# EasyEDA Pro project STM32F743ucosiii_lg.eprj, board 游戏主板_V2505
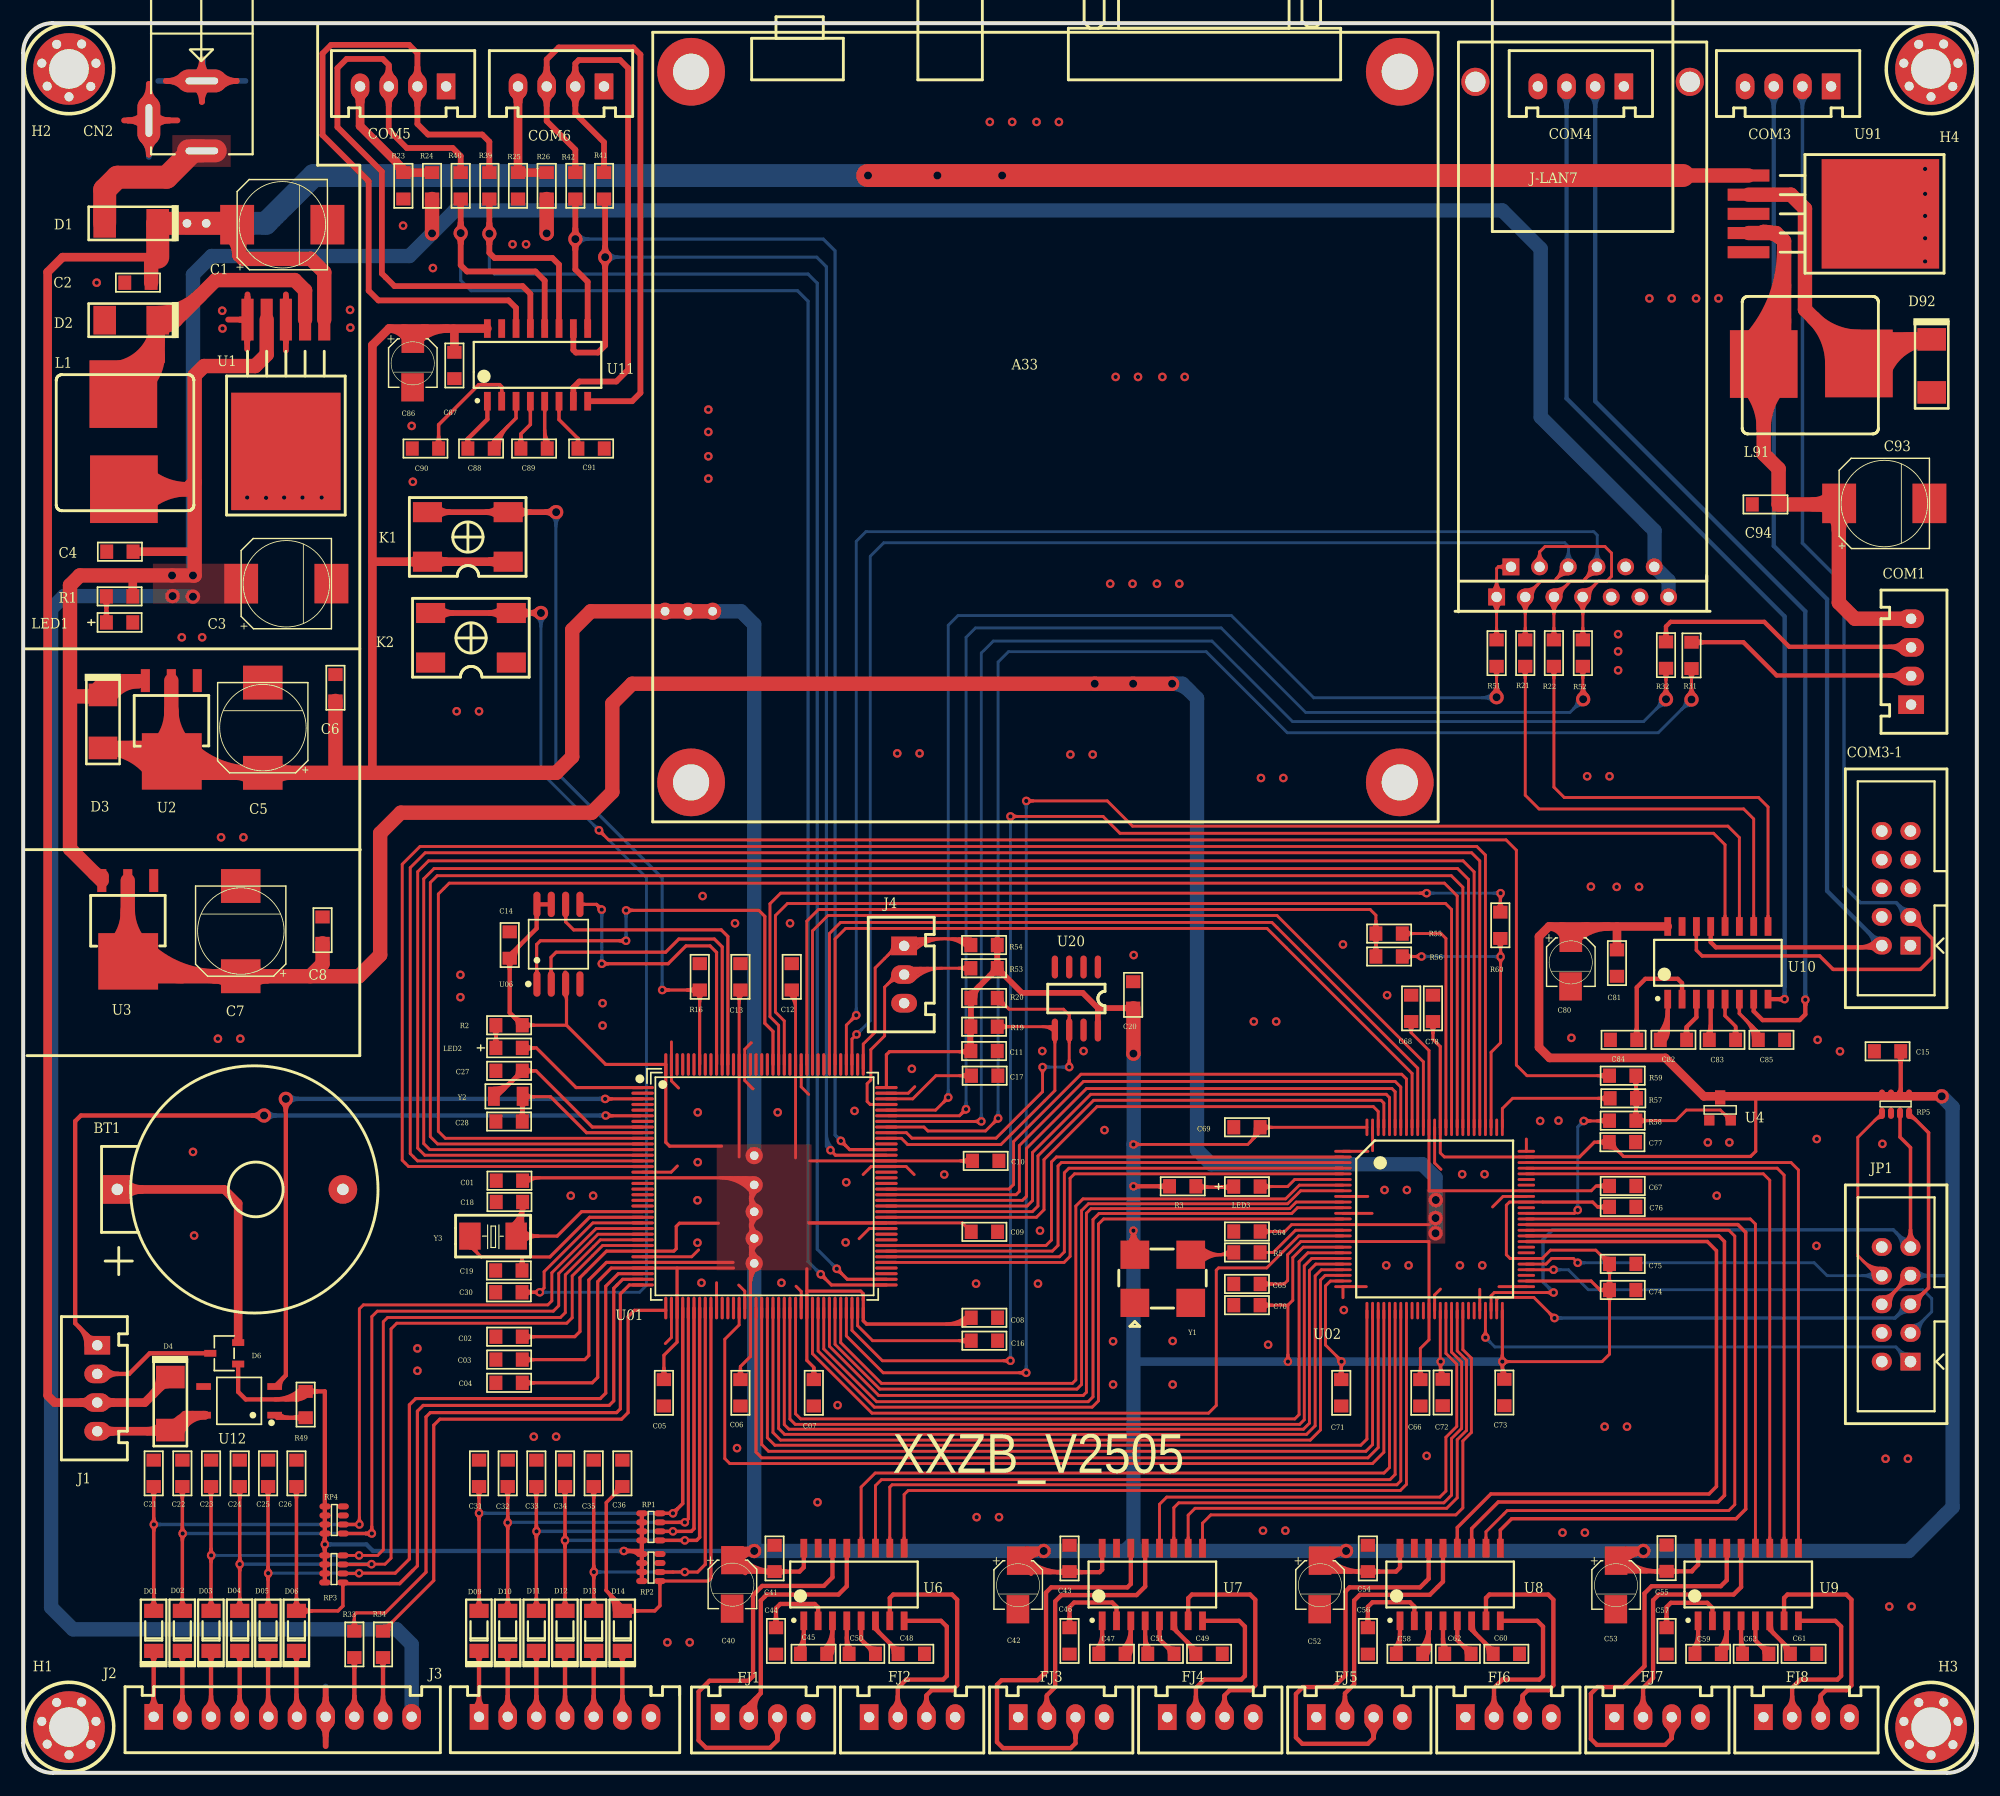
[diagram p1: board, top side]
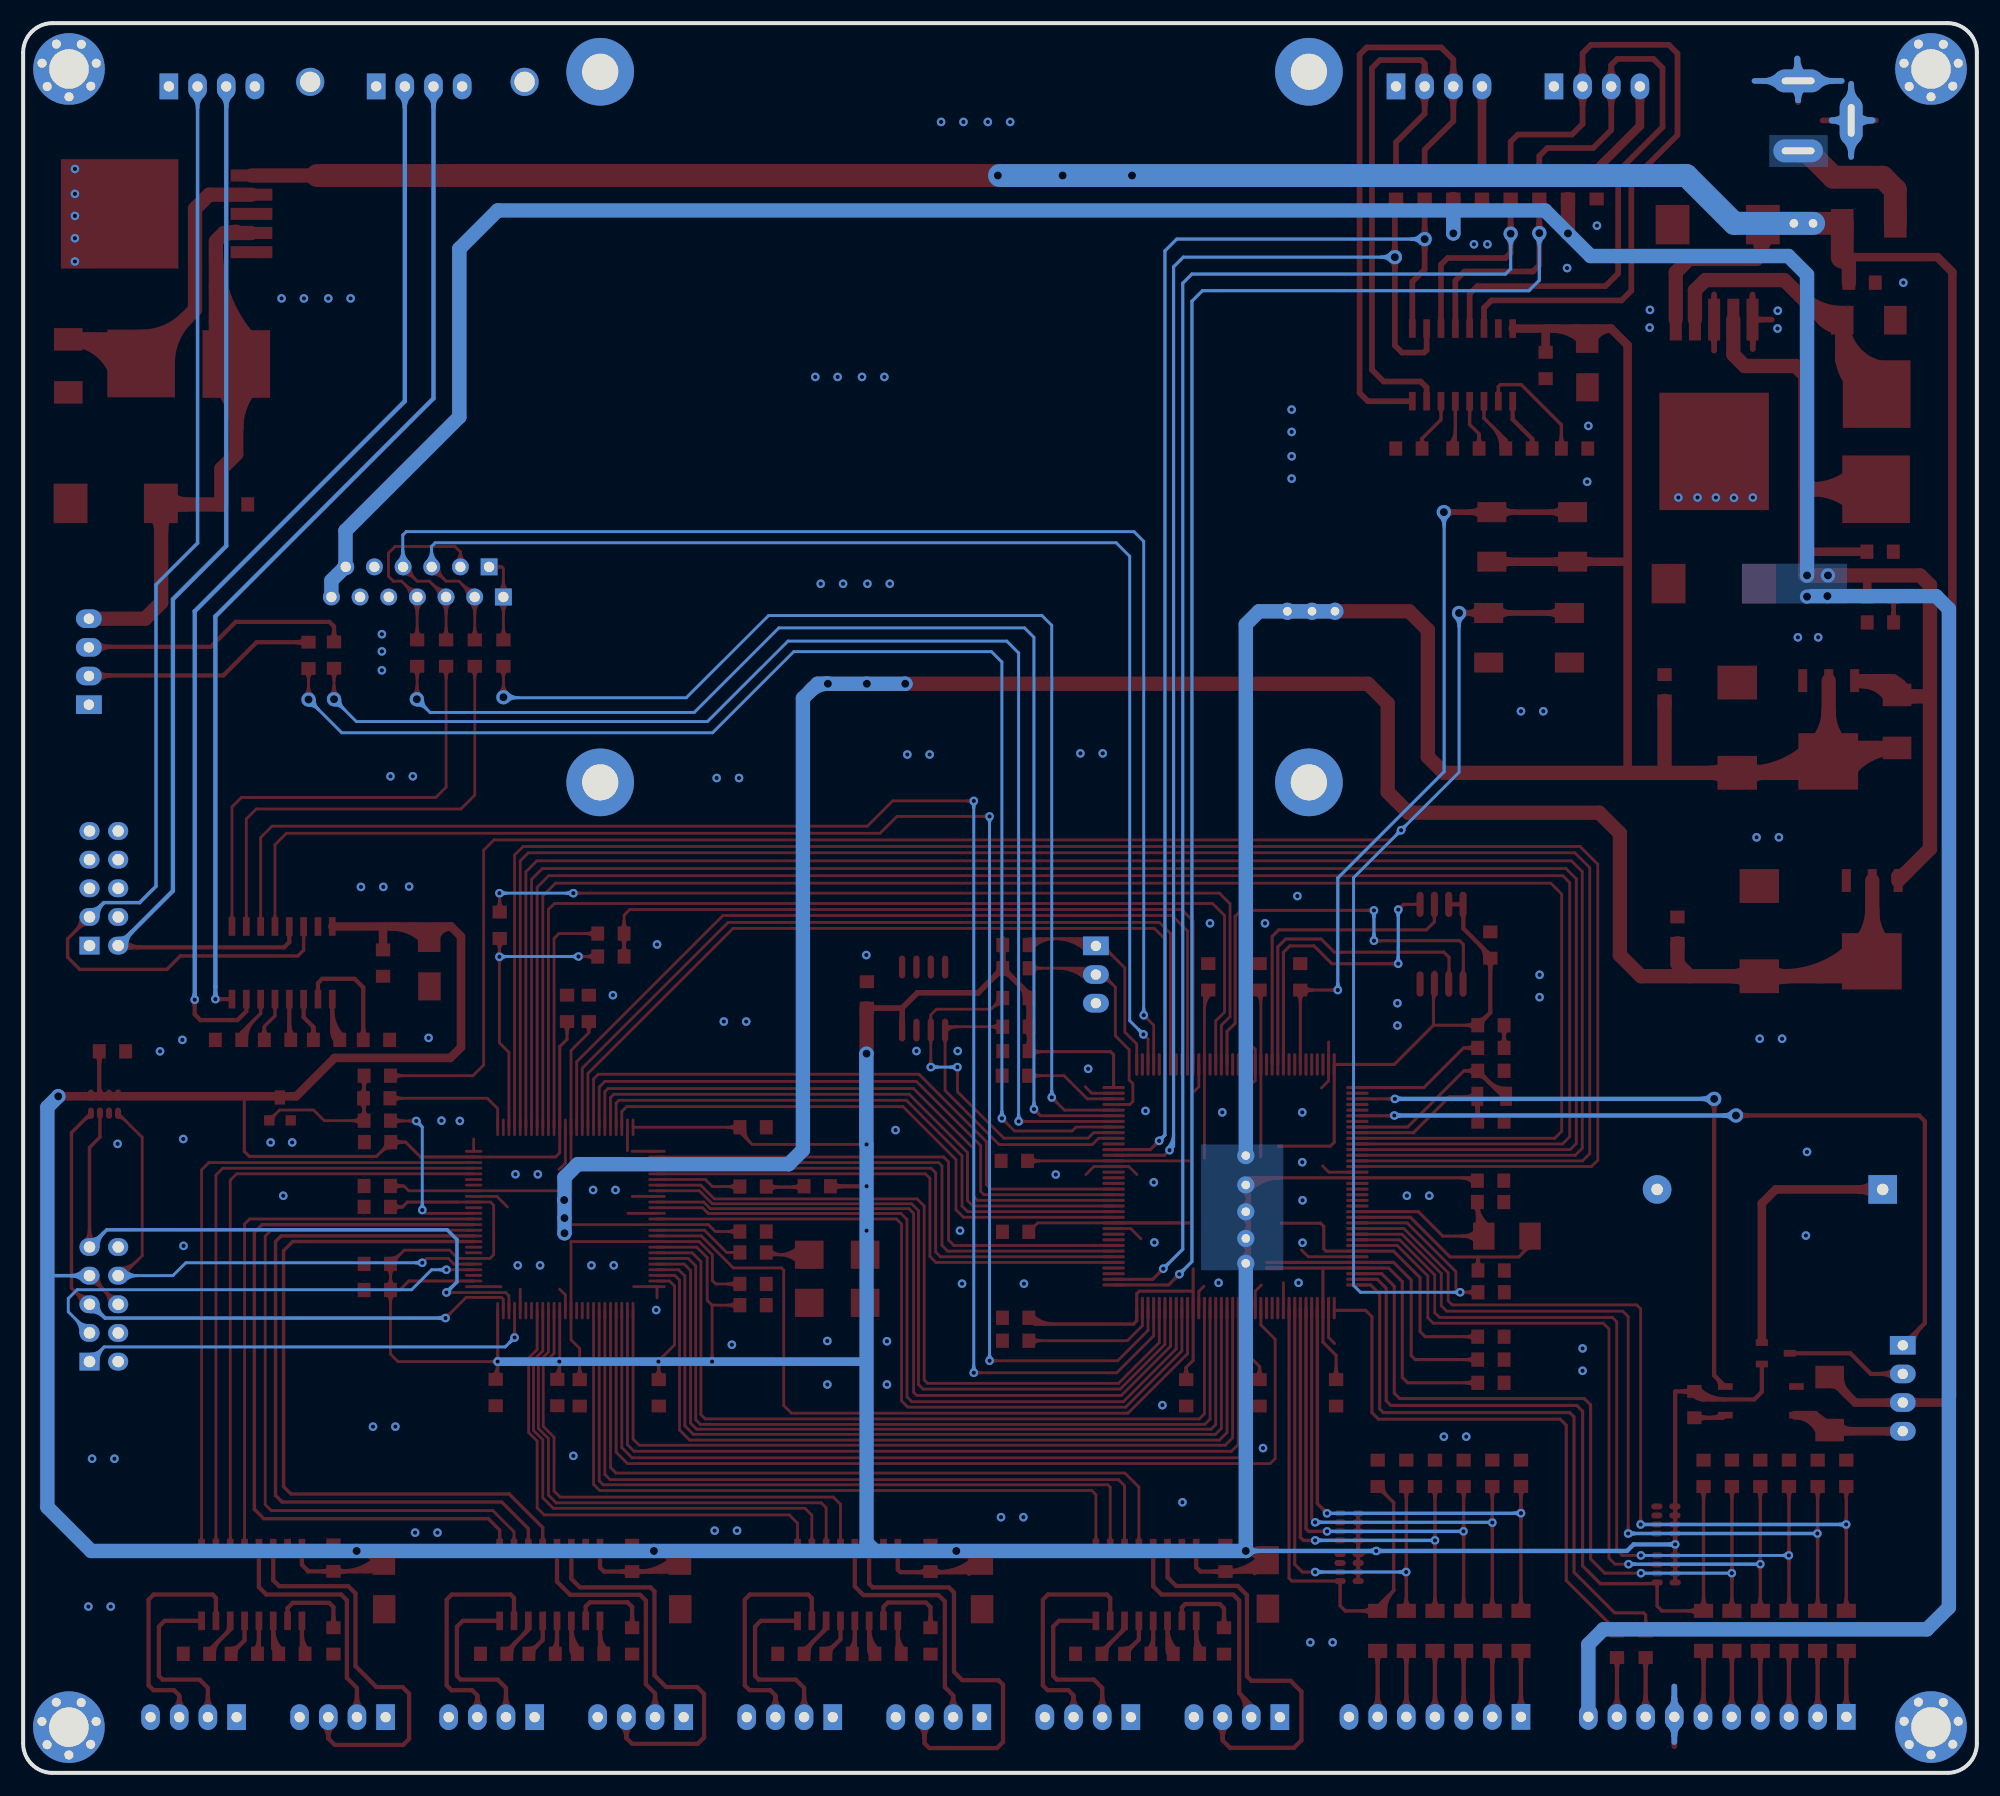
[diagram p2: board, bottom side, seen from below]

Outline 173.23 x 155.23 mm; copper layers: Top Layer, Bottom Layer. Coordinates in mm from the lower left corner of the outline.
Outline path: 0,152.57 0,2.65 arc(0.78,0.78) 2.65,0 170.57,0 arc(172.45,0.78) 173.23,2.65 173.23,152.57 arc(173.23,152.58) 173.23,152.59 arc(172.45,154.46) 170.57,155.23 2.68,155.23 arc(2.67,155.23) 2.67,155.23 arc(2.66,155.23) 2.65,155.23 arc(0.78,154.45) 0,152.57 ; 0.11,152.57 0.11,2.65 arc(0.86,0.86) 2.65,0.11 170.57,0.11 arc(172.37,0.86) 173.11,2.65 173.11,152.57 arc(172.37,154.37) 170.57,155.11 2.65,155.11 arc(0.86,154.37) 0.11,152.57
Stack: Top Layer 0.0356mm / Dielectric1 0.32mm FR-4 er 4.8 / Bottom Layer 0.0356mm

## Design rules (mm)
net R54: Inside Board Components
net R53: Inside Board Components
net U01: Inside Board Components
net R58: Inside Board Components
net R57: Inside Board Components
net R56: Inside Board Components
net R55: Inside Board Components
net U12: Inside Board Components
net R49: Inside Board Components
net D4: Inside Board Components
net BT1: Inside Board Components
net C01: Inside Board Components
net C1: Inside Board Components
net C02: Inside Board Components
net C2: Inside Board Components
net C03: Inside Board Components
net C3: Inside Board Components
net C04: Inside Board Components
net C4: Inside Board Components
net C05: Inside Board Components
net C5: Inside Board Components
net C06: Inside Board Components
net C07: Inside Board Components
net C7: Inside Board Components
net C08: Inside Board Components
net C8: Inside Board Components
net C09: Inside Board Components
net C10: Inside Board Components
net C11: Inside Board Components
net C12: Inside Board Components
net C13: Inside Board Components
net C14: Inside Board Components
net C15: Inside Board Components
net C16: Inside Board Components
net C17: Inside Board Components
net C21: Inside Board Components
net C22: Inside Board Components
net C23: Inside Board Components
net C24: Inside Board Components
net C25: Inside Board Components
net C26: Inside Board Components
net C27: Inside Board Components
net C28: Inside Board Components
net C30: Inside Board Components
net C31: Inside Board Components
net C32: Inside Board Components
net C33: Inside Board Components
net C34: Inside Board Components
net C35: Inside Board Components
net C36: Inside Board Components
net C40: Inside Board Components
net C41: Inside Board Components
net C42: Inside Board Components
net C43: Inside Board Components
net C44: Inside Board Components
net C45: Inside Board Components
net C46: Inside Board Components
net C47: Inside Board Components
net C48: Inside Board Components
net C49: Inside Board Components
net C50: Inside Board Components
net C51: Inside Board Components
net C52: Inside Board Components
net C53: Inside Board Components
net C54: Inside Board Components
net C55: Inside Board Components
net C56: Inside Board Components
net C57: Inside Board Components
net C58: Inside Board Components
net C59: Inside Board Components
net C60: Inside Board Components
net C61: Inside Board Components
net C62: Inside Board Components
net C63: Inside Board Components
net C64: Inside Board Components
net C65: Inside Board Components
net C66: Inside Board Components
net C67: Inside Board Components
net C68: Inside Board Components
net C69: Inside Board Components
net C70: Inside Board Components
net C71: Inside Board Components
net C72: Inside Board Components
net C73: Inside Board Components
net C74: Inside Board Components
net C75: Inside Board Components
net C76: Inside Board Components
net C77: Inside Board Components
net C78: Inside Board Components
net C80: Inside Board Components
net C81: Inside Board Components
net C82: Inside Board Components
net C83: Inside Board Components
net C84: Inside Board Components
net C85: Inside Board Components
net C86: Inside Board Components
net C87: Inside Board Components
net C88: Inside Board Components
net C89: Inside Board Components
net C90: Inside Board Components
net C91: Inside Board Components
net CN2: Inside Board Components
net COM1: Inside Board Components
net COM3-1: Inside Board Components
net COM3: Inside Board Components
net COM4: Inside Board Components
net COM5: Inside Board Components
net COM6: Inside Board Components
net D1: Inside Board Components
net D2: Inside Board Components
net D3: Inside Board Components
net D01: Inside Board Components
net D02: Inside Board Components
net D03: Inside Board Components
net D04: Inside Board Components
net D05: Inside Board Components
net D06: Inside Board Components
net FJ1: Inside Board Components
net FJ2: Inside Board Components
net FJ3: Inside Board Components
net FJ4: Inside Board Components
net FJ5: Inside Board Components
net FJ6: Inside Board Components
net FJ7: Inside Board Components
net FJ8: Inside Board Components
net J1: Inside Board Components
net JP1: Inside Board Components
net K1: Inside Board Components
net K2: Inside Board Components
net L1: Inside Board Components
net LED1: Inside Board Components
net LED2: Inside Board Components
net LED3: Inside Board Components
net R1: Inside Board Components
net R2: Inside Board Components
net R3: Inside Board Components
net R5: Inside Board Components
net R16: Inside Board Components
net R21: Inside Board Components
net R22: Inside Board Components
net R23: Inside Board Components
net R24: Inside Board Components
net R25: Inside Board Components
net R26: Inside Board Components
net R31: Inside Board Components
net R32: Inside Board Components
net R33: Inside Board Components
net R39: Inside Board Components
net R40: Inside Board Components
net R41: Inside Board Components
net R42: Inside Board Components
net RP1: Inside Board Components
net RP2: Inside Board Components
net RP5: Inside Board Components
net U1: Inside Board Components
net U02: Inside Board Components
net U4: Inside Board Components
net U6: Inside Board Components
net U7: Inside Board Components
net U8: Inside Board Components
net U9: Inside Board Components
net U10: Inside Board Components
net Y1: Inside Board Components
net Y2: Inside Board Components
net H1: Inside Board Components
net H2: Inside Board Components
net H3: Inside Board Components
net H4: Inside Board Components
net U2: Inside Board Components
net U3: Inside Board Components
net Y3: Inside Board Components
net C18: Inside Board Components
net C19: Inside Board Components
net D09: Inside Board Components
net D10: Inside Board Components
net D11: Inside Board Components
net D12: Inside Board Components
net D13: Inside Board Components
net D14: Inside Board Components
net J2: Inside Board Components
net RP3: Inside Board Components
net RP4: Inside Board Components
net J3: Inside Board Components
net R34: Inside Board Components
net U11: Inside Board Components
net C6: Inside Board Components
net A33: Inside Board Components
net D6: Inside Board Components
net C20: Inside Board Components
net C93: Inside Board Components
net C94: Inside Board Components
net D92: Inside Board Components
net J4: Inside Board Components
net L91: Inside Board Components
net R19: Inside Board Components
net R20: Inside Board Components
net R51: Inside Board Components
net R52: Inside Board Components
net R59: Inside Board Components
net R60: Inside Board Components
net U20: Inside Board Components
net U91: Inside Board Components
net J-LAN7: Inside Board Components
net U06: Inside Board Components
net C9: 游戏主板_V2503
net C39: 游戏主板_V2503
net CN1: 游戏主板_V2503
net EC1: 游戏主板_V2503
net EC2: 游戏主板_V2503
net EC3: 游戏主板_V2503
net EC4: 游戏主板_V2503
net PL1: 游戏主板_V2503
net R4: 游戏主板_V2503
net R6: 游戏主板_V2503
net R44: 游戏主板_V2503
net U5: 游戏主板_V2503
net U14: 游戏主板_V2503
net U15: 游戏主板_V2503
net U16: 游戏主板_V2503
net U17: 游戏主板_V2503
net C92: 游戏主板_V2503
net C95: 游戏主板_V2503
net JP5: 游戏主板_V2503
net U90: 游戏主板_V2503
net COM4-1: 游戏主板_V2503
net J-UART: 游戏主板_V2503
net R14: 游戏主板_V2503
net R15: 游戏主板_V2503
net J?: 游戏主板_V2503
net J88: 游戏主板_V2503
spacing Clearance (default): track to track 0.178, other pairs 0.178 to 0.178
track width Width (default): min 0.254, default 0.254, max 2.54
differential pair DiffPairsRouting (default): width min 0.381, default 0.381, max 0.381; gap min 0.254, default 0.254
via RoutingVias (default): diameter min 0.508, default 0.889, max 12.7; hole min 0.381, default 0.635, max 7.112

## Placement (name value [footprint] x y rotation side)
A33  TP  [A33安卓小板]  55.84 84.37 0 top
BT1  3V  [BATTERY_CR2032]  8.4 51.78 270 top
C01  104  [0805]  44.31 52.55 180 top
C1  680uF/25V  [EC_SMD_8*6]  23.03 137.3 90 top
C02  104  [0805]  44.28 38.72 180 top
C2  104  [0805]  11.39 132.17 180 top
C03  104  [0805]  44.28 36.69 180 top
C3  220uF/16V  [EC_SMD_8*6]  23.38 105.47 90 top
C04  104  [0805]  44.28 34.63 180 top
C4  104  [0805]  9.79 108.32 180 top
C5  470uF/16V  [EC_SMD_8*6]  21.3 92.72 180 top
C05  104  [0805]  56.83 34.91 270 top
C6  104  [C0805]  27.72 95.08 90 top
C06  104  [0805]  63.61 34.91 270 top
C7  470uF/16V  [EC_SMD_8*6]  19.34 74.69 180 top
C07  104  [0805]  70.12 34.91 270 top
C8  104  [C0805]  26.58 73.6 90 top
C08  104  [0805]  84.06 40.4 0 top
C09  104  [0805]  84.06 48.02 0 top
C10  104  [0805]  84.18 54.31 0 top
C11  104  [0805]  84.04 64.05 0 top
C12  104  [0805]  68.16 69.46 90 top
C13  104  [0805]  63.61 69.46 90 top
C14  104  [0805]  43.17 72.28 90 top
C15  104  [0805]  166.43 64.02 180 top
C16  2.2uF  [0805]  84.06 38.37 0 top
C17  2.2uF  [0805]  84.09 61.86 0 top
C18  30PF  [0805]  41.97 50.66 0 top
C19  30PF  [0805]  41.92 44.59 0 top
C20  104  [0805]  98.41 70.19 270 top
C21  104  [C0805]  11.62 25.44 90 top
C22  104  [C0805]  14.16 25.44 90 top
C23  104  [C0805]  16.7 25.44 90 top
C24  104  [C0805]  19.24 25.44 90 top
C25  104  [C0805]  21.76 25.44 90 top
C26  104  [C0805]  24.27 25.44 90 top
C27  30PF  [0805]  41.95 62.29 0 top
C28  30PF  [0805]  41.95 57.8 0 top
C30  100NF  [0805]  44.26 42.66 180 top
C31  104  [0805]  40.45 25.44 90 top
C32  104  [0805]  42.99 25.44 90 top
C33  104  [0805]  45.53 25.44 90 top
C34  104  [0805]  48.07 25.44 90 top
C35  104  [0805]  50.61 25.44 90 top
C36  104  [0805]  53.15 25.44 90 top
C40  10uF/16V  [EC_SMD_4*5.3]  62.9 18.91 0 top
C41  104  [C0805]  66.64 17.89 90 top
C42  10uF/16V  [EC_SMD_4*5.3]  88.23 18.86 0 top
C43  104  [C0805]  92.77 17.89 90 top
C44  104  [C0805]  66.76 12.92 270 top
C45  104  [C0805]  68.92 10.6 0 top
C46  104  [C0805]  92.77 12.92 270 top
C47  104  [C0805]  95.36 10.6 0 top
C48  104  [C0805]  79.92 10.6 180 top
C49  104  [C0805]  106.31 10.6 180 top
C50  104  [C0805]  73.24 10.6 0 top
C51  104  [C0805]  99.71 10.6 0 top
C52  10uF/16V  [EC_SMD_4*5.3]  114.97 18.86 0 top
C53  10uF/16V  [EC_SMD_4*5.3]  141.21 18.86 0 top
C54  104  [C0805]  119.22 17.89 90 top
C55  104  [C0805]  145.68 17.92 90 top
C56  104  [C0805]  119.22 12.92 270 top
C57  104  [C0805]  145.68 12.92 270 top
C58  104  [C0805]  121.73 10.6 0 top
C59  104  [C0805]  148.2 10.6 0 top
C60  104  [C0805]  132.65 10.6 180 top
C61  104  [C0805]  158.99 10.6 180 top
C62  104  [C0805]  126.02 10.6 0 top
C63  104  [C0805]  152.41 10.6 0 top
C64  104  [0805]  107.33 48.04 0 top
C65  104  [C0805]  107.33 43.4 0 top
C66  104  [C0805]  123.86 34.91 270 top
C67  104  [C0805]  140.63 52.08 0 top
C68  104  [C0805]  123.05 66.66 90 top
C69  104  [C0805]  109.66 57.29 180 top
C70  104  [C0805]  109.66 41.52 180 top
C71  104  [C0805]  116.85 34.91 270 top
C72  104  [C0805]  125.84 34.94 270 top
C73  104  [C0805]  131.31 34.94 270 top
C74  104  [C0805]  140.63 42.86 0 top
C75  104  [C0805]  140.63 45.17 0 top
C76  104  [C0805]  140.63 50.23 0 top
C77  104  [C0805]  140.6 55.97 0 top
C78  104  [C0805]  124.98 66.66 90 top
C80  10uF/16V  [EC_SMD_4*5.3]  137.2 74.08 0 top
C81  104  [0805]  141.29 73.01 270 top
C82  104  [0805]  145.12 65.04 0 top
C83  104  [0805]  149.47 65.04 0 top
C84  104  [0805]  143.04 65.04 180 top
C85  104  [0805]  156.15 65.04 180 top
C86  10uF/16V  [EC_SMD_4*5.3]  34.58 127.19 0 top
C87  104  [0805]  38.27 126 270 top
C88  104  [0805]  39.46 117.46 0 top
C89  104  [0805]  44.16 117.46 0 top
C90  104  [0805]  36.87 117.46 180 top
C91  104  [0805]  51.55 117.46 180 top
C93  220uF/16V  [EC_SMD_8*6]  164.99 112.59 90 top
C94  104  [0805]  155.61 112.51 180 top
CN2  PowerJACK  [POWER_DC12V]  15.89 143.85 180 top
COM1  4P座子（2.54mm）  [4SIP4]  167.35 94.75 90 top
COM3  4P座子（2.54mm）  [4SIP4]  160.26 149.57 180 top
COM3-1  CON5*2  [JYNJ_10]  167.3 73.39 90 top
COM4  4P座子（2.54mm）  [4SIP4]  141.9 149.57 180 top
COM5  4P座子（2.54mm）  [4SIP4]  37.53 149.57 180 top
COM6  4P座子（2.54mm）  [4SIP4]  51.52 149.57 180 top
D1  SS34  [SOD-1808]  7.28 137.43 180 top
D01  4148  [SOD-123]  11.62 14.41 270 top
D2  SS24  [SOD-1808]  7.28 128.84 180 top
D02  4148  [SOD-123]  14.16 14.41 270 top
D3  1N5819HW  [SOD-1808]  7.12 90.92 270 top
D03  4148  [SOD-123]  16.7 14.41 270 top
D4  SS24  [SOD-1808]  13.09 30.44 270 top
D04  4148  [SOD-123]  19.24 14.41 270 top
D05  4148  [SOD-123]  21.76 14.41 270 top
D6  -  [BAT54C]  17.87 37.25 0 top
D06  4148  [SOD-123]  24.27 14.41 270 top
D09  4148  [SOD-123]  40.45 14.41 270 top
D10  4148  [SOD-123]  42.99 14.41 270 top
D11  4148  [SOD-123]  45.53 14.41 270 top
D12  4148  [SOD-123]  48.07 14.41 270 top
D13  4148  [SOD-123]  50.61 14.41 270 top
D14  4148  [SOD-123]  53.15 14.41 270 top
D92  SS24  [SOD-1808]  169.18 122.44 270 top
FJ1  4P座子（2.54mm）  [4SIP4]  61.81 4.99 0 top
FJ2  4P座子（2.54mm）  [4SIP4]  75.02 4.99 0 top
FJ3  4P座子（2.54mm）  [4SIP4]  88.23 4.99 0 top
FJ4  4P座子（2.54mm）  [4SIP4]  101.44 4.99 0 top
FJ5  4P座子（2.54mm）  [4SIP4]  114.64 4.99 0 top
FJ6  4P座子（2.54mm）  [4SIP4]  127.85 4.99 0 top
FJ7  4P座子（2.54mm）  [4SIP4]  141.06 4.99 0 top
FJ8  4P座子（2.54mm）  [4SIP4]  154.27 4.99 0 top
H1  TP  [HOLE_6MM_3MM5]  4.11 4.11 0 top
H2  TP  [HOLE_6MM_3MM5]  4.11 151.11 0 top
H3  TP  [HOLE_6MM_3MM5]  169.13 4.1 0 top
H4  TP  [HOLE_6MM_3MM5]  169.11 151.11 0 top
J1  4P座子（2.54mm）  [4SIP4]  6.62 37.96 270 top
J2  CON10  [SIP10(2.54)]  11.62 5.02 0 top
J3  CON7  [SIP7(2.54)]  40.45 5.02 0 top
J4  SWD  [4SIP3]  78.12 73.37 270 top
J-LAN7  -  [UART-ETH-7]  127.24 105.7 0 top
JP1  10P180度双列插针（2.54mm）  [JYNJ_10]  167.3 36.51 90 top
K1  小方按键  [4KEY-2]  42.96 107.43 180 top
K2  小方按键  [4KEY-2]  43.24 98.49 180 top
L1  33mH  [DG220]  8.93 122.29 270 top
L91  33mH  [DG220]  162.73 125.01 180 top
LED1  LED_RED  [LED-0805]  7.43 102.04 0 top
LED2  LED_RED  [LED-0805]  41.95 64.33 0 top
LED3  LED_RED  [LED-0805]  107.33 52.03 0 top
NOREF  -  [Pad_ie1277]  61.15 103.04 0 top
NOREF#2  -  [Pad_ie1280]  64.83 52.18 0 top
NOREF#3  -  [Pad_ie1275]  16.27 137.43 0 top
NOREF#4  -  [Pad_ie1279]  64.83 54.78 0 top
NOREF#5  -  [Pad_ie1278]  56.93 103.04 0 top
NOREF#6  -  [Pad_ie1274]  14.57 137.43 0 top
NOREF#7  -  [Pad_ie1282]  64.83 45.22 0 top
NOREF#8  -  [Pad_ie1283]  64.83 47.43 0 top
NOREF#9  -  [Pad_ie1281]  64.83 49.8 0 top
NOREF#10  -  [Pad_ie1276]  58.97 103.04 0 top
R1  1K  [0805]  9.77 104.36 180 top
R2  1K  [0805]  44.28 66.33 180 top
R3  1K  [0805]  101.64 52.06 0 top
R5  10R  [0805]  109.66 46.19 180 top
R16  10K  [0805]  60.01 69.46 90 top
R19  103  [0805]  86.37 66.21 180 top
R20  103  [0805]  86.37 68.75 180 top
R21  10K  [0805]  133.16 100.5 270 top
R22  10K  [0805]  135.7 100.5 270 top
R23  10K  [0805]  33.74 139.59 90 top
R24  10K  [0805]  36.28 139.59 90 top
R25  10K  [0805]  43.9 139.59 90 top
R26  10K  [0805]  46.44 139.59 90 top
R31  10K  [0805]  147.89 97.96 90 top
R32  10K  [0805]  145.63 97.98 90 top
R33  10K  [0805]  29.4 12.61 270 top
R34  10K  [0805]  31.94 12.61 270 top
R39  10K  [0805]  41.36 139.59 90 top
R40  10K  [0805]  38.82 139.59 90 top
R41  10K  [0805]  51.52 139.59 90 top
R42  10K  [0805]  48.98 139.59 90 top
R49  301  [0805]  25.08 31.53 90 top
R51  10K  [0805]  130.62 98.16 90 top
R52  10K  [0805]  138.26 98.16 90 top
R53  10K  [0805]  86.37 71.39 180 top
R54  10K  [0805]  86.37 73.44 180 top
R55  10R  [0805]  119.93 74.46 0 top
R56  10R  [0805]  119.93 72.43 0 top
R57  10R  [0805]  143.01 59.86 180 top
R58  10R  [0805]  142.96 57.87 180 top
R59  10R  [0805]  142.96 61.86 180 top
R60  10R  [0805]  130.95 76.37 270 top
RP1  472  [0603-8P4R]  54.88 20.66 90 top
RP2  472  [0603-8P4R]  54.88 17.06 90 top
RP3  472  [0603-8P4R]  26.78 16.93 90 top
RP4  472  [0603-8P4R]  26.81 21.27 90 top
RP5  472  [0603-8P4R]  167.17 58.53 180 top
U1  LM2596S  [TO-263]  26.73 128.89 180 top
U01  STM32H743ZIT6  [STM32H743-LQFP-144]  65.75 52.06 270 top
U2  AMS1117-3.3  [LM1117-3.3]  15.48 96.89 180 top
U02  A3P250-100  [A3P250-LQFP100]  117 55.16 0 top
U3  AMS1117-1.5  [LM1117-3.3]  11.62 79.16 180 top
U4  IMP809TEUR-T(ACXX)  [809T]  149.47 57.9 0 top
U6  -  [SIPEX3232EEN]  73.67 16.75 0 top
U06  FM25L16  [SOIC-8_L5.3-W5.3-P1.27-LS8.0-BL]  47.49 73.52 0 top
U7  -  [SIPEX3232EEN]  100.11 16.75 0 top
U8  -  [SIPEX3232EEN]  126.5 16.75 0 top
U9  -  [SIPEX3232EEN]  152.92 16.75 0 top
U10  -  [SIPEX3232EEN]  150.23 71.87 0 top
U11  -  [SIPEX3232EEN]  45.63 124.88 0 top
U12  GAQY211G2S  [固态继电器SOP-4]  19.19 33.03 180 top
U20  FM24CL04  [SO-8]  95.29 71.49 180 top
U91  LM2596S  [TO-263]  152.95 141.67 270 top
Y1  11.0596M  [OSC-SMD4P-11.0592M]  98.56 41.72 0 top
Y2  32.768K  [OSC-SMD2P-32.768K]  43.04 60.03 180 top
Y3  25MHz  [OSC-SMD2P_25M]  41.69 47.64 0 top

## Footprints (pads in the part's own frame, mm; a bottom-side part is the same pattern mirrored in y, then rotated)
4KEY-2
  rect 2.575x1.778 smd: 1(-0.069,0) 1(7.087,0) 2(-0.069,-4.394) 2(7.087,-4.394)
4SIP3
  rect 1.651x2.286 hole 0.914: 1(0,0)
  oval 1.651x2.286 hole 0.914: 2(2.54,0) 3(5.08,0)
4SIP4
  rect 1.651x2.286 hole 0.914: 1(0,0)
  oval 1.651x2.286 hole 0.914: 2(2.54,0) 3(5.08,0) 4(7.62,0)
0603-8P4R
  oval 0.533x1 smd: 1(0,0) 2(0,-1.6) 3(0.8,0) 4(0.8,-1.6) 5(1.6,0) 6(1.6,-1.6) 7(2.4,0) 8(2.4,-1.6)
0805
  rect 1.143x1.27 smd: 1(0,0) 2(2.337,0)
809T
  rect 0.914x0.914 smd: 1(0,0) 3(1.905,0)
  rect 0.914x1.27 smd: 2(0.965,2.032)
A3P250-LQFP100
  oval 1.55x0.25 smd: 1(0,0) 2(0,-0.5) 3(0,-1) 4(0,-1.5) 5(0,-2) 6(0,-2.5) 7(0,-3) 8(0,-3.5) 9(0,-4) 10(0,-4.5) 11(0,-5) 12(0,-5.5) 13(0,-6) 14(0,-6.5) 15(0,-7) 16(0,-7.5) 17(0,-8) 18(0,-8.5) 19(0,-9) 20(0,-9.5) 21(0,-10) 22(0,-10.5) 23(0,-11) 24(0,-11.5) 25(0,-12) 51(16.25,-12) 52(16.25,-11.5) 53(16.25,-11) 54(16.25,-10.5) 55(16.25,-10) 56(16.25,-9.5) 57(16.25,-9) 58(16.25,-8.5) 59(16.25,-8) 60(16.25,-7.5) 61(16.25,-7) 62(16.25,-6.5) 63(16.25,-6) 64(16.25,-5.5) 65(16.25,-5) 66(16.25,-4.5) 67(16.25,-4) 68(16.25,-3.5) 69(16.25,-3) 70(16.25,-2.5) 71(16.25,-2) 72(16.25,-1.5) 73(16.25,-1) 74(16.25,-0.5) 75(16.25,0)
  oval 0.25x1.55 smd: 26(2.125,-14.125) 27(2.625,-14.125) 28(3.125,-14.125) 29(3.625,-14.125) 30(4.125,-14.125) 31(4.625,-14.125) 32(5.125,-14.125) 33(5.625,-14.125) 34(6.125,-14.125) 35(6.625,-14.125) 36(7.125,-14.125) 37(7.625,-14.125) 38(8.125,-14.125) 39(8.625,-14.125) 40(9.125,-14.125) 41(9.625,-14.125) 42(10.125,-14.125) 43(10.625,-14.125) 44(11.125,-14.125) 45(11.625,-14.125) 46(12.125,-14.125) 47(12.625,-14.125) 48(13.125,-14.125) 49(13.625,-14.125) 50(14.125,-14.125) 76(14.125,2.125) 77(13.625,2.125) 78(13.125,2.125) 79(12.625,2.125) 80(12.125,2.125) 81(11.625,2.125) 82(11.125,2.125) 83(10.625,2.125) 84(10.125,2.125) 85(9.625,2.125) 86(9.125,2.125) 87(8.625,2.125) 88(8.125,2.125) 89(7.625,2.125) 90(7.125,2.125) 91(6.625,2.125) 92(6.125,2.125) 93(5.625,2.125) 94(5.125,2.125) 95(4.625,2.125) 96(4.125,2.125) 97(3.625,2.125) 98(3.125,2.125) 99(2.625,2.125) 100(2.125,2.125)
A33安卓小板
  round 6 hole 3.2: 1(3.4,66.5) 1(3.4,3.5) 1(66.2,66.5) 1(66.2,3.5)
BAT54C
  rect 1.07x0.6 smd: 1(1.235,-0.95) 2(1.235,0.95) 3(-1.235,0)
BATTERY_CR2032
  rect 2.54x2.54 hole 1.016: 1(0,0)
  round 2.54 hole 1.016: 2(0,19.99)
C0805
  rect 1.143x1.27 smd: 1(0,0) 2(2.337,0)
DG220
  rect 5.995x6 smd: 1(0,0) 2(8.433,0.051)
EC_SMD_4*5.3
  rect 2x2.5 smd: 1(0,0) 2(-0.025,-4.3)
EC_SMD_8*6
  rect 3.5x3 smd: 1(0.013,4.012) 2(0.013,-3.988)
HOLE_6MM_3MM5
  round 1.27 hole 0.8: 1(-2.413,0.508) 1(-1.931,-1.524) 1(-1.092,2.184) 1(0,-2.464) 1(1.117,2.21) 1(1.931,-1.55) 1(2.388,0.508)
  round 6.35 hole 3.5: 1(0,0)
JYNJ_10
  rect 1.575x1.778 hole 1.016: 1(0,0)
  oval 1.575x1.778 hole 1.016: 2(0,2.54) 3(2.54,0) 4(2.54,2.54) 5(5.08,0) 6(5.08,2.54) 7(7.62,0) 8(7.62,2.54) 9(10.16,0) 10(10.16,2.54)
LED-0805
  rect 1.143x1.27 smd: 1(0,0) 2(2.337,0)
LM1117-3.3
  rect 0.8x2.032 smd: 1(0,0) 2(2.3,0) 3(4.6,0)
  rect 5.3x5 smd: 2(2.26,7.163)
OSC-SMD2P-32.768K
  rect 1.05x1.7 smd: 1(-1.275,0) 2(1.275,0)
OSC-SMD2P_25M
  rect 1.9x2.4 smd: 1(-2.05,0) 2(2.05,0)
OSC-SMD4P-11.0592M
  rect 2.54x2.5 smd: 1(0,0) 2(4.953,0) 3(4.953,4.267) 4(0,4.267)
Pad_ie1274
  round 1.524 hole 0.762: 0(0,0)
Pad_ie1275
  round 1.524 hole 0.762: 1(0,0)
Pad_ie1276
  round 1.524 hole 0.762: 2(0,0)
Pad_ie1277
  round 1.524 hole 0.762: 3(0,0)
Pad_ie1278
  round 1.524 hole 0.762: 4(0,0)
Pad_ie1279
  round 1.524 hole 0.762: 5(0,0)
Pad_ie1280
  round 1.524 hole 0.762: 6(0,0)
Pad_ie1281
  round 1.524 hole 0.762: 7(0,0)
Pad_ie1282
  round 1.524 hole 0.762: 8(0,0)
Pad_ie1283
  round 1.524 hole 0.762: 9(0,0)
POWER_DC12V
  oval 4.4x2.032 hole 2.9x0.6: 1(0,0) 2(0,-6.2)
  oval 2.032x4.4 hole 0.6x2.9: 3(4.7,-2.7)
SIP7(2.54)
  rect 1.651x2.286 hole 0.914: 1(0,0)
  oval 1.651x2.286 hole 0.914: 2(2.54,0) 3(5.08,0) 4(7.62,0) 5(10.16,0) 6(12.7,0) 7(15.24,0)
SIP10(2.54)
  rect 1.651x2.286 hole 0.914: 1(0,0)
  oval 1.651x2.286 hole 0.914: 2(2.54,0) 3(5.08,0) 4(7.62,0) 5(10.16,0) 6(12.7,0) 7(15.24,0) 8(17.78,0) 9(20.32,0) 10(22.86,0)
SIPEX3232EEN
  rect 0.6x1.65 smd: 1(-4.445,-3.221) 2(-3.175,-3.221) 3(-1.905,-3.221) 4(-0.635,-3.221) 5(0.635,-3.221) 6(1.905,-3.221) 7(3.175,-3.221) 8(4.445,-3.221) 9(4.445,3.221) 10(3.175,3.221) 11(1.905,3.221) 12(0.635,3.221) 13(-0.635,3.221) 14(-1.905,3.221) 15(-3.175,3.221) 16(-4.445,3.221)
SO-8
  oval 0.559x2.032 smd: 1(0,-0.007) 2(1.27,-0.007) 3(2.54,-0.007) 4(3.81,-0.007) 5(3.81,5.58) 6(2.54,5.58) 7(1.27,5.58) 8(0,5.58)
SOD-123
  rect 1.25x1.7 smd: 1(0,0) 2(3.55,0)
SOD-1808
  rect 2x2.54 smd: 1(0,0) 2(-4.7,0)
SOIC-8_L5.3-W5.3-P1.27-LS8.0-BL
  oval 0.63x2.25 smd: 1(-1.905,-3.53) 2(-0.635,-3.53) 3(0.635,-3.53) 4(1.905,-3.53) 5(1.905,3.53) 6(0.635,3.53) 7(-0.635,3.53) 8(-1.905,3.53)
STM32H743-LQFP-144
  oval 0.28x2 smd: 1(-8.75,-10.8) 2(-8.25,-10.8) 3(-7.75,-10.8) 4(-7.25,-10.8) 5(-6.75,-10.8) 6(-6.25,-10.8) 7(-5.75,-10.8) 8(-5.25,-10.8) 9(-4.75,-10.8) 10(-4.25,-10.8) 11(-3.75,-10.8) 12(-3.25,-10.8) 13(-2.75,-10.8) 14(-2.25,-10.8) 15(-1.75,-10.8) 16(-1.25,-10.8) 17(-0.75,-10.8) 18(-0.25,-10.8) 19(0.25,-10.8) 20(0.75,-10.8) 21(1.25,-10.8) 22(1.75,-10.8) 23(2.25,-10.8) 24(2.75,-10.8) 25(3.25,-10.8) 26(3.75,-10.8) 27(4.25,-10.8) 28(4.75,-10.8) 29(5.25,-10.8) 30(5.75,-10.8) 31(6.25,-10.8) 32(6.75,-10.8) 33(7.25,-10.8) 34(7.75,-10.8) 35(8.25,-10.8) 36(8.75,-10.8) 73(8.75,10.8) 74(8.25,10.8) 75(7.75,10.8) 76(7.25,10.8) 77(6.75,10.8) 78(6.25,10.8) 79(5.75,10.8) 80(5.25,10.8) 81(4.75,10.8) 82(4.25,10.8) 83(3.75,10.8) 84(3.25,10.8) 85(2.75,10.8) 86(2.25,10.8) 87(1.75,10.8) 88(1.25,10.8) 89(0.75,10.8) 90(0.25,10.8) 91(-0.25,10.8) 92(-0.75,10.8) 93(-1.25,10.8) 94(-1.75,10.8) 95(-2.25,10.8) 96(-2.75,10.8) 97(-3.25,10.8) 98(-3.75,10.8) 99(-4.25,10.8) 100(-4.75,10.8) 101(-5.25,10.8) 102(-5.75,10.8) 103(-6.25,10.8) 104(-6.75,10.8) 105(-7.25,10.8) 106(-7.75,10.8) 107(-8.25,10.8) 108(-8.75,10.8)
  oval 2x0.28 smd: 37(10.8,-8.75) 38(10.8,-8.25) 39(10.8,-7.75) 40(10.8,-7.25) 41(10.8,-6.75) 42(10.8,-6.25) 43(10.8,-5.75) 44(10.8,-5.25) 45(10.8,-4.75) 46(10.8,-4.25) 47(10.8,-3.75) 48(10.8,-3.25) 49(10.8,-2.75) 50(10.8,-2.25) 51(10.8,-1.75) 52(10.8,-1.25) 53(10.8,-0.75) 54(10.8,-0.25) 55(10.8,0.25) 56(10.8,0.75) 57(10.8,1.25) 58(10.8,1.75) 59(10.8,2.25) 60(10.8,2.75) 61(10.8,3.25) 62(10.8,3.75) 63(10.8,4.25) 64(10.8,4.75) 65(10.8,5.25) 66(10.8,5.75) 67(10.8,6.25) 68(10.8,6.75) 69(10.8,7.25) 70(10.8,7.75) 71(10.8,8.25) 72(10.8,8.75) 109(-10.8,8.75) 110(-10.8,8.25) 111(-10.8,7.75) 112(-10.8,7.25) 113(-10.8,6.75) 114(-10.8,6.25) 115(-10.8,5.75) 116(-10.8,5.25) 117(-10.8,4.75) 118(-10.8,4.25) 119(-10.8,3.75) 120(-10.8,3.25) 121(-10.8,2.75) 122(-10.8,2.25) 123(-10.8,1.75) 124(-10.8,1.25) 125(-10.8,0.75) 126(-10.8,0.25) 127(-10.8,-0.25) 128(-10.8,-0.75) 129(-10.8,-1.25) 130(-10.8,-1.75) 131(-10.8,-2.25) 132(-10.8,-2.75) 133(-10.8,-3.25) 134(-10.8,-3.75) 135(-10.8,-4.25) 136(-10.8,-4.75) 137(-10.8,-5.25) 138(-10.8,-5.75) 139(-10.8,-6.25) 140(-10.8,-6.75) 141(-10.8,-7.25) 142(-10.8,-7.75) 143(-10.8,-8.25) 144(-10.8,-8.75)
TO-263
  rect 1.07x3.7 smd: 1(0,0) 2(1.7,0) 3(3.4,0) 4(5.1,0) 5(6.8,0)
  rect 9.7x10.41 smd: 3(3.4,11.684)
UART-ETH-7
  round 2.5 hole 1.8: 0(1.5,44.27) 0(20.5,44.27)
  rect 1.5x1.5 hole 0.914: 1(3.38,-1.4) 1(4.65,1.27)
  round 1.5 hole 0.914: 2(7.19,1.27) 2(11,-1.4) 3(5.92,-1.4) 3(9.73,1.27) 4(8.46,-1.4) 4(12.27,1.27) 5(13.54,-1.4) 5(14.81,1.27) 6(17.35,1.27) 6(18.62,-1.4) 7(16.08,-1.4)
固态继电器SOP-4
  rect 1.3x0.595 smd: 1(-3.15,1.27) 2(-3.15,-1.27) 3(3.15,-1.27) 4(3.15,1.27)

## Nets
As in the schematic, except:
3.3V: C01.1 C02.1 C03.1 C04.1 C5.1 C05.1 C6.1 C06.1 C07.1 C08.1 C09.1 C10.1 C11.1 C12.1 C13.1 C14.1 C15.1 C20.2 C40.1 C41.1 C42.1 C43.1 C52.1 C53.1 C54.1 C55.1 C69.1 C70.1 C71.1 C72.1 C73.1 C74.1 C75.1 C76.1 C77.1 C78.1 C80.1 C81.1 C86.1 C87.1 D3.1 D6.1 JP1.6 JP1.7 K1.1 NOREF.3 NOREF#2.6 NOREF#4.5 NOREF#5.4 NOREF#7.8 NOREF#8.9 NOREF#9.7 NOREF#10.2 R2.1 R3.1 R19.2 R20.2 R49.2 R53.1 R54.1 RP1.1 RP1.3 RP1.5 RP1.7 RP2.1 RP2.3 RP2.5 RP2.7 RP3.1 RP3.3 RP3.5 RP3.7 RP4.1 RP4.3 RP4.5 RP4.7 RP5.2 RP5.4 RP5.6 RP5.8 U01.17 U01.30 U01.32 U01.33 U01.39 U01.52 U01.62 U01.72 U01.84 U01.95 U01.108 U01.121 U01.131 U01.144 U2.2 U02.18 U02.24 U02.39 U02.50 U02.52 U02.56 U02.66 U02.74 U02.87 U02.100 U4.2 U06.3 U06.7 U06.8 U6.16 U7.16 U8.16 U9.16 U10.16 U11.16 U20.8 Y1.4
V12: C1.1 C2.1 D1.2 D4.2 J1.3 NOREF#3.1 NOREF#6.0 U1.1 U91.1

Pads without a net: A33 1; COM3-1 1 4 6 7 8 9 10; H1 1; H2 1; H3 1; H4 1; J-LAN7 0 7; JP1 4; RP2 6 8; RP4 6 8; RP5 5; U01 2 4 5 7 20 21 22 48 49 75 76 81 82 91 92 93 98 110 113 116 117 122 126 127 128 129 132 136 137 139 140; U02 34 35 36 44 45 53 57 58 65 69 70 77; Y1 1

## Via types
v1: diameter 0.762, hole 0.381, Top Layer to Bottom Layer, 211 vias
v2: diameter 1.27, hole 0.711, Top Layer to Bottom Layer, 33 vias

## Routing (per net, layer and track width the routed paths; a pad name or vN(x,y) marks a point on that pad's centre or on a via; arc(x,y) is an arc through that point)
1.5V: length 316.3
  Top Layer w0.254: 124.64,51.66 139.01,51.66 139.43,52.08 C67.1 ; 124.63,47.16 113.27,47.16 112.1,45.99 112.1,43.7 111.8,43.4 C65.2 ; 124.63,48.66 112.46,48.66 111.85,48.04 C64.2 ; 123.05,65.67 C68.1 ; 123.05,65.67 124.63,64.09 124.63,51.65 ; 123.05,65.67 arc(122.97,66.03) 122.75,66.33 ; 123.05,65.67 arc(123.13,66.03) 123.35,66.33 ; 124.63,47.16 124.63,38.45 123.86,37.68 C66.1 ; 109.98,48.36 arc(110.33,48.13) 110.74,48.04 arc(110.33,47.96) 109.98,47.73 ; 140.31,51.77 arc(139.96,52) 139.55,52.08 arc(139.96,52.16) 140.31,52.4 ; 123.55,35.23 arc(123.78,35.58) 123.86,35.99 arc(123.95,35.58) 124.18,35.23 ; 109.98,43.71 arc(110.33,43.48) 110.74,43.4 arc(110.33,43.31) 109.98,43.08
  Top Layer w1.27: 101.84,96.61 54.01,96.61 52.26,94.86 52.26,87.01 50.43,85.18 33.52,85.18 31.69,83.35 31.69,72.56 29.81,70.68 10.68,70.68 U3.2 ; 9.32,72.04 U3.2 ; 25.49,70.68 26.58,71.77 C8.1 ; 18.47,70.06 arc(17.79,70.52) 16.99,70.68 arc(17.79,70.84) 18.47,71.29 ; 10.83,73.32 arc(13.75,71.36) 17.2,70.68 ; 8.04,73.32 arc(8.99,74.73) 9.32,76.41 ; 20.19,70.06 arc(20.87,70.52) 21.67,70.68 arc(20.87,70.84) 20.19,71.29 ; 9.93,72.42 arc(11.86,71.13) 14.14,70.68 ; 9.32,76.6 arc(9.67,74.82) 10.68,73.32
  Bottom Layer w1.27: v2(125.21,47.89) 125.21,52.84 124.04,54.01 105.34,54.01 104.08,55.28 104.08,95.31 102.78,96.61 94.98,96.61 ; 103.43,95.96 arc(102.71,96.44) v2(101.87,96.61) arc(102.61,96.54) 103.24,96.15
  vias: v2(95.01,96.61) v2(98.41,96.61) v2(125.23,50.84) v2(125.21,49.24)
3.3V: length 1365.7
  Top Layer w0.254: 69.8,54.31 C10.1 ; C09.1 83.27,48.81 76.75,48.81 ; C71.1 116.85,36.59 115.46,37.99 115.46,43.22 115.89,43.66 U02.24 ; 134.71,50.66 131.76,50.66 131.48,50.38 131.48,45.99 131.81,45.66 134.66,45.66 135.39,46.39 139.41,46.39 C75.1 140.63,37.17 139.97,36.51 v1(131.13,36.51) ; U02.74 125.99,54.66 125.63,55.01 U02.87 ; 63.5,54.66 63.5,69.34 C13.1 ; U02.18 113.48,46.66 112.56,45.73 112.56,41.95 112.13,41.52 ; C69.1 109.66,56.86 108.57,55.77 98.46,55.77 ; C70.1 112.13,41.52 ; 112.13,41.52 v1(112.13,36.51) ; 68.5,54.58 68.5,69.12 C12.1 ; C72.1 125.63,35.15 U02.39 ; 109.67,57.28 U02.100 ; 116.85,35.96 arc(116.81,36.16) 116.7,36.33 ; 108.76,55.95 arc(109.12,56.52) 109.22,57.19 ; 125.63,35.76 arc(125.7,35.39) 125.92,35.07 ; 140.94,42.48 arc(140.71,42.14) 140.63,41.73 arc(140.55,42.14) 140.31,42.48 ; 131.31,36.69 arc(131.51,36.56) 131.74,36.51 arc(131.51,36.47) 131.31,36.33 ; 111.95,36.69 arc(112.08,36.89) 112.13,37.13 arc(112.18,36.89) 112.31,36.69 ; 117.06,36.33 arc(116.91,36.11) 116.85,35.84 ; 116.54,35.23 arc(116.77,35.58) 116.85,35.99 arc(116.93,35.58) 117.17,35.23 ; 140.18,45.24 arc(140.11,45.59) 139.91,45.89 ; 109.98,57.6 arc(110.34,57.37) 110.76,57.28 ; 116.53,36.91 arc(116.69,36.8) 116.88,36.77 ; 98.62,55.59 arc(98.82,55.72) 99.05,55.77 arc(98.82,55.81) 98.62,55.95 ; 125.63,35.99 arc(125.59,36.17) 125.49,36.33 ; 109.15,56.34 arc(109.41,56.74) 109.47,57.21 ; 140.31,44.8 arc(140.55,44.45) 140.63,44.04 arc(140.71,44.45) 140.94,44.8 ; 83.86,53.99 arc(83.52,54.23) 83.1,54.31 arc(83.52,54.39) 83.86,54.62 ; 63.87,69.14 arc(63.59,68.74) 63.5,68.26 ; 68.5,68.34 arc(68.39,68.87) 68.09,69.32 ; 140.94,43.24 arc(140.71,43.59) 140.63,44 arc(140.55,43.59) 140.31,43.24 ; 125.63,36.38 arc(125.75,35.77) 126.1,35.25 ; 63.69,69.32 arc(63.55,69.11) 63.5,68.87 ; 63.5,68.51 arc(63.43,68.85) 63.24,69.14 ; 125.47,35.25 arc(125.59,35.43) 125.63,35.65 ; 68.5,68.95 arc(68.44,69.25) 68.27,69.5 ; 125.85,36.33 arc(125.69,36.09) 125.63,35.81 ; 109.98,41.83 arc(110.33,41.6) 110.74,41.52 arc(110.33,41.43) 109.98,41.2 ; 68.5,67.72 arc(68.35,68.49) 67.91,69.14 ; 116.62,36.51 arc(116.57,36.79) 116.41,37.03 ; 139.76,46.04 arc(140.16,45.78) 140.63,45.68 ; 110.72,57.28 arc(110.32,57.2) 109.98,56.98
  Top Layer w0.28: U02.87 125.63,64.44 124.98,65.09 C78.1 ; C03.1 49.82,36.69 50.18,37.05 50.18,43.75 51.73,45.31 62.96,45.31 ; 64.5,45.22 64.5,36.96 63.61,36.08 C06.1 ; 64.67,52.81 44.56,52.81 C01.1 ; 44.28,38.85 C02.1 48.93,38.72 49.39,39.18 49.39,43.95 51.74,46.31 57.71,46.31 57.93,46.52 57.93,48.5 58.2,48.78 61.66,48.78 ; 74.5,40.13 U01.72 ; U02.52 138.99,43.66 139.79,42.86 ; 139.79,42.86 C74.1 ; 139.79,42.86 arc(140.06,42.8) 140.28,42.61 ; 139.79,42.86 arc(140.06,42.93) 140.28,43.11 ; 74.5,41.97 74.5,42.53 74.27,42.76 69.5,42.76 ; 76.55,60.81 76.55,63.72 76.82,64 83.99,64 C11.1 ; 134.71,50.66 139.13,50.66 139.56,50.23 C76.1 ; 62.99,44.81 52.17,44.81 51.16,43.8 50.97,43.6 50.97,35.12 50.48,34.63 C04.1 ; 69.5,44.74 69.5,36.62 70.12,36 C07.1 ; 48.2,66.33 48.2,70.01 48.1,70.12 ; 48.2,66.33 51.68,62.86 U01.144 57,55.96 57.34,55.61 61.94,55.61 ; 48.2,66.33 R2.1 ; 153.58,60.03 153.58,55.16 153.12,54.7 141.87,54.7 C77.1 139.28,55.97 137.97,54.66 U02.74 ; C73.1 131.13,35.11 U02.50 ; C05.1 56.83,37.07 58,38.24 58,44.8 ; 44.62,52.92 arc(44.74,52.84) 44.89,52.81 ; 44.59,38.42 arc(44.93,38.64) 45.32,38.72 arc(44.93,38.8) 44.59,39.03 ; 131.13,35.58 arc(131.19,35.29) 131.35,35.05 ; 65.18,51.78 arc(64.68,51.02) 64.5,50.13 ; 64.5,50.43 arc(64.57,50.05) 64.79,49.73 ; 140.3,55.66 arc(139.96,55.89) 139.56,55.97 arc(139.96,56.05) 140.3,56.27 ; 44.59,34.33 arc(44.93,34.55) 45.32,34.63 arc(44.93,34.71) 44.59,34.94 ; 56.53,35.22 arc(56.75,35.56) 56.83,35.95 arc(56.91,35.56) 57.14,35.22 ; 131.3,36.34 arc(131.17,36.15) 131.13,35.93 arc(131.09,36.15) 130.96,36.34 ; 65.18,47.03 arc(64.68,46.27) 64.5,45.38 ; 64.5,48.72 arc(64.62,48.08) 64.99,47.54 ; 64.5,45.98 arc(64.57,45.6) 64.79,45.28 ; 65.27,52.57 arc(65.01,52.75) 64.71,52.81 ; 64.79,47.43 arc(64.57,47.11) 64.5,46.73 ; 44.59,66.64 arc(44.93,66.41) 45.32,66.33 arc(44.93,66.25) 44.59,66.03 ; 65.08,52.38 arc(64.6,52.7) 64.03,52.81 ; 64.48,51.78 arc(63.35,52.54) 62.01,52.81 ; 64.79,52.18 arc(64.57,51.86) 64.5,51.48 ; 64.99,51.98 arc(64.62,51.44) 64.5,50.8 ; 63.31,35.22 arc(63.53,35.56) 63.61,35.95 arc(63.69,35.56) 63.92,35.22 ; 64.5,48.04 arc(64.57,47.66) 64.79,47.34 ; 130.94,35.24 arc(131.08,35.46) 131.13,35.71 ; 48.2,68.56 arc(48.15,68.83) 48,69.06 ; 65.18,49.42 arc(64.68,48.66) 64.5,47.77 ; 64.88,52.18 arc(64.18,52.64) 63.36,52.81 ; 131.13,36.25 arc(131.24,35.71) 131.55,35.24 ; 45.81,52.81 arc(45.17,52.68) 44.62,52.31 ; 64.79,49.82 arc(64.57,49.49) 64.5,49.11 ; 70.42,35.22 arc(70.2,35.56) 70.12,35.95 arc(70.04,35.56) 69.81,35.22 ; 83.02,64 arc(83.41,64.07) 83.73,64.29 ; 64.59,51.94 arc(63.63,52.58) 62.49,52.81 ; 64.79,52.13 arc(64.04,52.63) 63.16,52.81 ; 64.5,49.39 arc(64.68,48.49) 65.18,47.73 ; 140.32,50.53 arc(139.98,50.31) 139.58,50.23 arc(139.98,50.15) 140.32,49.92 ; 64.5,51.78 arc(64.68,50.88) 65.18,50.12 ; 64.99,49.62 arc(64.62,49.08) 64.5,48.44 ; 64.99,47.23 arc(64.63,46.69) 64.5,46.05 ; 44.59,36.38 arc(44.93,36.61) 45.32,36.69 arc(44.93,36.77) 44.59,37 ; 64.5,47.33 arc(64.68,46.44) 65.18,45.68 ; 125.29,66.36 arc(125.06,66.02) 124.98,65.62 arc(124.9,66.02) 124.68,66.36 ; 141.03,55.91 arc(141.1,55.57) 141.29,55.28 ; 64.79,45.37 arc(64.57,45.05) 64.5,44.67 ; 141.45,55.12 arc(141.06,55.38) 140.6,55.47 ; 64.39,51.74 arc(63.21,52.53) 61.81,52.81 ; 131.3,36.68 arc(131.17,36.87) 131.13,37.09 arc(131.09,36.87) 130.96,36.68 ; 64.99,52.33 arc(64.46,52.68) 63.84,52.81 ; 83.73,63.68 arc(83.38,63.91) 82.96,64 ; 65.18,44.98 arc(64.68,44.22) 64.5,43.32 ; 45.14,52.81 arc(44.75,52.73) 44.42,52.51 ; 64.5,46.66 arc(64.62,46.02) 64.99,45.48 ; 64.99,45.17 arc(64.62,44.63) 64.5,44 ; 64.68,51.98 arc(63.77,52.59) 62.69,52.81 ; 64.5,51.1 arc(64.62,50.46) 64.99,49.92
  Top Layer w0.305: JP1.6 JP1.7 ; C08.1 83.5,39.84 74.79,39.84 74.5,40.13 ; 69.7,48.81 U01.84 ; 82.59,39.84 arc(83.34,39.99) 83.98,40.42 ; 81.85,39.84 arc(82.89,40.05) 83.76,40.63 ; 166.04,42.88 arc(166.43,43.45) 166.56,44.13 ; 166.56,43.4 arc(166.79,43.73) 166.87,44.13 ; 165.49,42.33 arc(165.27,41.99) 165.19,41.59 ; 166.01,42.85 arc(165.63,42.27) 165.49,41.59 ; 83.33,39.84 arc(83.8,39.93) 84.2,40.2 ; 167.2,43.5 arc(166.7,43.4) 166.28,43.12 ; 164.86,42.23 arc(165.35,42.33) 165.77,42.6
  Top Layer w0.381: U06.8 U06.7 ; 115.94,17.89 121.7,17.89 122.06,18.25 U8.16 ; 43.17,72.53 45.55,74.92 45.55,76.59 ; C42.1 89.24,17.84 95.44,17.84 95.67,18.07 U7.16 ; U9.16 148.48,18.5 147.94,17.97 147.94,17.92 142.15,17.92 ; C14.1 43.17,67.45 R2.1 ; 48.1,70.12 48.1,71 ; v1(98.44,52.06) R3.1 ; 54.9,23.06 54.88,23.04 54.88,19.75 54.85,19.72 v1(53.28,19.72) ; U6.16 69.23,18.28 68.85,17.89 63.92,17.89 C40.1 ; 98.44,46.11 v1(98.44,48.12) ; v1(98.44,48.12) arc(98.28,47.38) 97.84,46.78 ; v1(98.44,48.12) arc(98.62,47.41) 99.12,46.88 ; RP3.1 26.78,33.87 R49.2 24.37,33.16 19.77,33.16 19.1,33.83 D6.1 ; RP2.1 54.88,19.42 ; 166.43,60.08 C15.1 ; 114.74,18.37 arc(115.27,18.02) 115.89,17.89 ; 115.01,18.64 arc(115.84,18.09) 116.81,17.89 ; 62.94,18.69 arc(63.82,18.1) 64.87,17.89 ; 98.57,47.99 arc(98.47,47.84) 98.44,47.66 arc(98.4,47.84) 98.3,47.99 ; 26.92,20.17 arc(26.82,20.02) 26.78,19.85 arc(26.75,20.02) 26.65,20.17 ; 92.44,17.62 arc(92.2,17.79) 91.91,17.84 ; 88.53,18.91 arc(89.71,18.12) 91.11,17.84 ; 66.3,17.62 arc(66.01,17.82) 65.65,17.89 arc(66.01,17.96) 66.3,18.16 ; 88.26,18.64 arc(89.15,18.05) 90.19,17.84 ; 119.55,18.16 arc(119.85,17.96) 120.2,17.89 arc(119.85,17.82) 119.55,17.62 ; 63.23,17.92 arc(63.66,17.97) 64.04,17.77 arc(63.79,18.16) 63.71,18.62 ; 146.01,18.19 arc(146.31,17.99) 146.66,17.92 arc(146.31,17.85) 146.01,17.65 ; 54.86,19.67 arc(54.8,19.71) 54.74,19.72 ; 54.59,19.4 arc(54.23,19.64) 53.82,19.72 ; 66.97,17.62 arc(67.27,17.82) 67.62,17.89 arc(67.27,17.96) 66.97,18.16 ; 25.42,33.6 arc(25.71,33.8) 26.07,33.87 arc(25.71,33.94) 25.42,34.14 ; 23.3,33.16 arc(24.23,33.34) 25.02,33.87 ; 141.78,19.18 arc(143.18,18.25) 144.83,17.92 ; 140.98,18.37 arc(141.48,18.04) 142.07,17.92 ; 88.56,17.87 arc(88.99,17.92) 89.37,17.72 arc(89.11,18.11) 89.04,18.57 ; 166.16,63.69 arc(166.36,63.39) 166.43,63.04 arc(166.5,63.39) 166.7,63.69 ; 145.35,17.65 arc(145.05,17.85) 144.7,17.92 arc(145.05,17.99) 145.35,18.19 ; 53.41,19.86 arc(53.56,19.76) 53.74,19.72 arc(53.56,19.69) 53.41,19.59 ; 43.9,66.4 arc(43.84,66.69) 43.68,66.94 ; 88.8,19.18 arc(90.28,18.19) 92.03,17.84 ; 24.4,33.19 arc(24.59,33.49) 24.64,33.84 ; 93.11,18.16 arc(93.46,17.93) 93.88,17.84 ; 44.11,73.47 arc(43.74,72.92) 43.61,72.28 ; 93.63,17.84 arc(93.35,17.79) 93.11,17.62 ; 43.44,72.01 arc(43.24,71.71) 43.17,71.36 arc(43.1,71.71) 42.9,72.01 ; 118.88,17.62 arc(118.58,17.82) 118.23,17.89 arc(118.58,17.96) 118.88,18.16 ; 98.09,46.49 arc(98.35,46.84) 98.44,47.27 ; 63.21,18.96 arc(64.39,18.17) 65.79,17.89 ; 24.22,33.16 arc(24.8,33.27) 25.29,33.6 ; 87.99,18.37 arc(88.58,17.98) 89.27,17.84 ; 115.28,18.91 arc(116.4,18.16) 117.73,17.89 ; 45.67,76.15 arc(45.58,76.03) 45.55,75.88 ; 98.57,52.19 arc(98.72,52.09) 98.9,52.06 arc(98.72,52.02) 98.57,51.92 ; 43.46,72.82 arc(43.29,72.57) 43.23,72.28 ; 141.51,18.91 arc(142.61,18.18) 143.91,17.92 ; 115.55,19.18 arc(116.97,18.23) 118.65,17.89 ; 91.67,17.84 arc(92.09,17.93) 92.44,18.16 ; 63.48,19.23 arc(64.96,18.24) 66.71,17.89 ; 101.37,52.33 arc(101.07,52.13) 100.72,52.06 arc(101.07,51.99) 101.37,51.79 ; 166.32,60.42 arc(166.4,60.55) 166.43,60.7 ; 141.25,18.64 arc(142.05,18.11) 142.99,17.92 ; 98.44,47.42 arc(98.56,46.93) 98.91,46.56 ; 62.67,18.42 arc(63.25,18.03) 63.95,17.89 ; 26.65,20.44 arc(26.75,20.59) 26.78,20.77 arc(26.82,20.59) 26.92,20.44 ; 43.52,67.09 arc(43.87,66.86) 44.28,66.78 ; 22.38,33.16 arc(23.66,33.41) 24.75,34.14 ; 25.02,33.49 arc(24.73,33.43) 24.48,33.27
  Top Layer w0.508: U20.8 95.29,67.86 ; 95.29,67.86 C20.2 ; 95.29,67.86 93.94,69.2 88.56,69.2 R53.1 ; 84.04,69.05 R53.1 ; R53.1 86.37,74 ; R20.2 R19.2 83.99,66.15 83.99,64 ; 84.75,69.76 arc(84.46,69.33) 84.35,68.81 ; 86.6,73.16 arc(86.43,72.91) 86.37,72.61 arc(86.31,72.91) 86.15,73.16 ; 83.81,66.49 arc(83.98,66.74) 84.04,67.04 arc(84.09,66.74) 84.26,66.49 ; 84.26,68.46 arc(84.09,68.21) 84.04,67.92 arc(83.98,68.21) 83.81,68.46 ; 98.12,67.63 arc(97.88,67.8) 97.58,67.86 arc(97.88,67.91) 98.12,68.08 ; 85.88,70.89 arc(86.01,71.09) 86.06,71.32 ; 86.15,71.67 arc(86.31,71.92) 86.37,72.22 arc(86.43,71.92) 86.6,71.67 ; 83.99,65.5 arc(83.94,65.73) 83.81,65.92 ; 86.69,71.32 arc(86.74,71.09) 86.87,70.89 ; 83.81,64.33 arc(83.94,64.53) 83.99,64.75 ; 83.99,65 arc(84.06,64.64) 84.26,64.33 ; 85.72,70.74 arc(86.02,70.94) 86.37,71.01 arc(86.73,70.94) 87.02,70.74 ; 84.26,65.92 arc(84.06,65.61) 83.99,65.25
  Top Layer w0.762: 31,107.43 K1.1 ; 38.19,128.1 38.27,128.02 C87.1 ; 88.91,19.72 v2(90.49,19.72) arc(89.5,19.47) 88.75,18.77 ; v2(170.07,60.03) 148.98,60.03 145.58,63.44 135.32,63.44 134.38,64.38 134.38,74.2 135.27,75.09 ; 115.84,19.72 v2(117.28,19.72) arc(116.27,19.47) 115.49,18.76 ; 135.27,75.09 U10.16 ; 135.27,75.09 arc(136.09,74.83) 136.61,74.13 ; C81.1 141.29,75.09 ; R20.2 84.04,69.05 ; U4.2 150.53,60.03 ; C86.1 35.49,128.1 ; 31.05,88.71 31,88.76 31,126.63 32.47,128.1 ; 63.72,19.72 v2(64.83,19.72) arc(64.02,19.5) 63.45,18.88 ; 32.47,128.1 U11.16 ; 32.47,128.1 arc(33.38,127.85) 34.03,127.15 ; 142.07,19.72 v2(143.62,19.72) arc(142.55,19.47) 141.71,18.75 ; 35.12,107.07 arc(34.72,107.34) 34.25,107.43 arc(34.72,107.52) 35.12,107.79 ; 89.09,19.72 arc(88.53,19.58) 88.11,19.19 ; 36.64,107.79 arc(37.03,107.52) 37.5,107.43 arc(37.03,107.34) 36.64,107.07 ; 137.33,74.38 arc(136.95,74.89) 136.33,75.09 ; 142.13,19.72 arc(141.55,19.58) 141.1,19.19 ; 42.27,107.07 arc(41.88,107.34) 41.41,107.43 arc(41.88,107.52) 42.27,107.79 ; 138.69,75.09 arc(137.83,74.92) 137.1,74.43 ; 35.83,128.1 arc(35.1,127.96) 34.48,127.54 ; 34.71,127.51 arc(34.3,127.94) 33.73,128.1 ; 140.53,75.09 arc(138.96,74.78) 137.64,73.89 ; 115.86,19.72 arc(115.29,19.58) 114.85,19.19 ; 37.67,128.1 arc(36.24,127.82) 35.02,127
  Top Layer w1.27: v2(98.44,63.82) 98.44,67.83 ; 13.58,88.71 11.37,90.92 D3.1 arc(9.62,90.32) 11.55,88.64 ; 27.72,88.71 C6.1 ; U2.2 13.18,89.76 14.24,88.71 47.28,88.71 48.7,90.13 48.7,101.38 50.36,103.04 NOREF.3 ; 20.42,89.32 arc(19.75,88.87) 18.95,88.71 arc(19.75,88.55) 20.42,88.1 ; 13.18,94.32 arc(13.53,92.55) 14.54,91.04 ; 22.15,88.1 arc(22.82,88.55) 23.62,88.71 arc(22.82,88.87) 22.15,89.32 ; 11.9,91.04 arc(12.85,92.46) 13.18,94.13 ; 13.79,90.15 arc(15.38,89.08) 17.26,88.71 ; 12.59,89.38 arc(11.28,90.51) 9.59,90.92 ; 14.69,91.04 arc(17.27,89.32) 20.32,88.71
  Bottom Layer w0.305: JP1.7 171.01,44.13 ; 167.85,43.68 arc(168.35,44.02) 168.93,44.13 arc(168.35,44.25) 167.85,44.58 ; 167.63,44.37 arc(167.89,44.19) 168.2,44.13 arc(167.89,44.07) 167.63,43.9
  Bottom Layer w0.381: v1(26.78,20.31) 30.47,20.31 31.05,19.72 v2(64.83,19.72) ; 64.52,19.41 arc(64.17,19.64) 63.76,19.72 arc(64.17,19.81) 64.52,20.04 ; 53.41,19.86 arc(53.56,19.76) 53.74,19.72 arc(53.56,19.69) 53.41,19.59 ; 53.14,19.86 arc(52.99,19.76) 52.82,19.72 arc(52.99,19.69) 53.14,19.59 ; 26.92,20.17 arc(27.07,20.27) 27.24,20.31 arc(27.07,20.34) 26.92,20.44
  Bottom Layer w0.762: 98.44,36.51 v1(131.13,36.51)
  Bottom Layer w1.27: NOREF#5.4 63.67,103.04 64.83,101.87 NOREF#4.5 ; 98.46,55.77 98.46,63.79 ; 97.7,19.72 98.44,20.46 v1(98.44,55.77) ; NOREF#7.8 v2(64.83,19.72) 167.14,19.72 171.03,23.61 171.03,59.07 v2(170.07,60.03)
  vias: v1(116.88,36.51) v1(125.67,36.51)
GND: length 184.6
  Top Layer w0.254: 69.66,60.21 69,60.87 U01.120 ; U01.61 69,42.74 68.54,43.19 ; U02.46 129.13,42.92 ; U01.31 59.29,45.81 59.91,46.42 ; 64.58,64.78 64,64.2 64,61.43 64.73,60.69 ; 63.46,43.29 64,42.76 U01.51 ; 130.26,50.23 131.19,51.16 U02.67 ; 117,42.18 U02.25 119.07,43.16 ; U01.46 61.5,43.51 ; U02.12 119.58,49.66 ; U02.1 119.21,55.16 ; U02.75 133.25,56.24 ; 54.95,53.31 57.47,53.31 58.03,53.86 ; 74.49,53.1 75.19,53.81 78.3,53.81 79.01,53.1 ; U02.9 119.2,51.16 ; U02.88 125.13,54.12 125.69,53.56 ; 74.13,47.41 75.03,48.31 U01.83 ; 119.63,55.22 U02.99 ; 130.83,43.16 U02.51 ; 57.5,64.85 57.5,61.4 58.13,60.77 ; U01.38 57.5,38.65 56.96,38.11 ; 125.64,42.94 125.13,42.43 U02.38 ; 79.06,60.89 78.48,60.31 76.55,60.31
  Top Layer w0.508: 18.22,128.89 U1.5 19.93,131.12 ; 15.89,148.2 15.89,151.98 ; 12.69,150.05 15.89,150.05 ; 9,146.55 13.72,146.55 ; 11.19,143.52 11.19,145.56 ; 19.9,126.28 19.9,128.79 ; 11.19,147.66 11.19,149.8 ; 23.33,126.15 23.33,127.65 ; 26.86,2.43 26.86,7.51 ; 15.99,150.05 18.98,150.05 ; 23.33,129.65 23.33,131.12 ; 10.65,148.28 arc(11.05,148.87) 11.19,149.58 arc(11.33,148.87) 11.73,148.28 ; 12.86,150.05 arc(13.57,150.19) 14.16,150.59 ; 23.53,130.41 arc(23.39,130.63) 23.33,130.89 arc(23.28,130.63) 23.13,130.41 ; 26.46,5.74 arc(26.76,6.19) 26.86,6.71 arc(26.97,6.19) 27.26,5.74 ; 10.65,144.83 arc(11.05,144.23) 11.19,143.53 arc(11.33,144.23) 11.73,144.83 ; 15.35,149.51 arc(15.75,148.92) 15.89,148.21 arc(16.03,148.92) 16.43,149.51 ; 19.74,129.09 arc(19.51,128.94) 19.26,128.89 arc(19.51,128.84) 19.74,128.69 ; 11.73,147.09 arc(12.32,146.69) 13.03,146.55 arc(12.32,146.41) 11.73,146.01 ; 17.61,150.59 arc(18.21,150.19) 18.91,150.05 arc(18.21,149.91) 17.61,149.51 ; 19.74,130.41 arc(19.88,130.63) 19.93,130.89 arc(19.99,130.63) 20.13,130.41 ; 15.35,150.59 arc(15.75,151.19) 15.89,151.89 arc(16.03,151.19) 16.43,150.59 ; 23.53,127.38 arc(23.39,127.16) 23.33,126.9 arc(23.28,127.16) 23.13,127.38 ; 19.9,126.98 arc(19.86,127.19) 19.74,127.38 ; 14.16,149.51 arc(13.57,149.91) 12.87,150.05 ; 10.65,146.01 arc(10.05,146.41) 9.35,146.55 arc(10.05,146.69) 10.65,147.09 ; 20.13,127.38 arc(19.96,127.12) 19.9,126.82 ; 26.46,4.29 arc(26.76,3.85) 26.86,3.32 arc(26.97,3.85) 27.26,4.29
  Bottom Layer w0.508: 15.96,150.05 15.96,152.03 arc(15.81,151.25) 15.36,150.6 ; 15.89,148.35 CN2.2 ; 15.89,148.35 arc(16.02,148.97) 16.4,149.48 ; 15.89,148.35 arc(15.76,148.97) 15.38,149.48 ; 9.28,146.55 11.24,146.55 ; 26.86,2.78 26.86,7.71 ; 11.29,146.55 12.91,146.55 ; 12.91,146.55 arc(12.28,146.42) 11.75,146.04 ; 12.91,146.55 arc(12.28,146.69) 11.75,147.06 ; 12.02,150.05 19.75,150.05 ; 11.19,147.54 11.19,149.8 ; 11.19,143.32 11.19,144.79 ; 27.26,5.74 arc(26.97,6.19) 26.86,6.71 arc(26.76,6.19) 26.46,5.74 ; 10.65,147.09 arc(10.05,146.69) 9.35,146.55 arc(10.05,146.41) 10.65,146.01 ; 11.73,144.83 arc(11.33,144.23) 11.19,143.53 arc(11.05,144.23) 10.65,144.83 ; 10.65,148.28 arc(11.05,148.87) 11.19,149.58 arc(11.33,148.87) 11.73,148.28 ; 14.16,150.59 arc(13.57,150.19) 12.86,150.05 arc(13.57,149.91) 14.16,149.51 ; 27.26,4.29 arc(26.97,3.85) 26.86,3.32 arc(26.76,3.85) 26.46,4.29 ; 15.96,151.71 arc(16.08,151.1) 16.43,150.59 ; 17.61,149.51 arc(18.21,149.91) 18.91,150.05 arc(18.21,150.19) 17.61,150.59
  vias: v1(6.57,132.17) v1(14.11,100.72) v1(15.1,55.11) v1(15.2,47.69) v1(15.91,100.72) v1(17.31,65.14) v1(17.59,82.99) v1(17.69,129.68) v1(17.72,128.1) v1(19.29,65.14) v1(19.57,82.99) v1(19.9,113.12) v1(21.58,113.09) v1(23.18,113.12) v1(24.8,113.12) v1(26.51,113.12) v1(29.02,129.76) v1(29.04,128.18) v1(33.72,137.22) v1(34.48,119.47) v1(34.58,114.52) v1(34.99,37.68) v1(34.99,35.7) v1(36.36,133.46) v1(38.47,94.17) v1(38.8,70.8) v1(38.8,68.82) v1(40.45,94.17) v1(43.42,135.57) v1(44.62,135.57) v1(45.3,29.86) v1(47.28,29.86) v1(48.58,51.22) v1(50.56,51.22) v1(51.4,68.29) v1(51.4,66.31) v1(57.14,11.62) v1(59.12,11.62) v1(59.83,58.61) v1(59.83,54.19) v1(59.8,50.81) v1(59.8,47.05) v1(60.16,43.5) v1(60.26,77.79) v1(60.77,120.92) v1(60.77,118.94) v1(60.77,116.78) v1(60.77,114.8) v1(63.13,75.37) v1(63.31,28.84) v1(66.92,58.61) v1(67.25,43.5) v1(68.01,75.37) v1(70.45,24.04) v1(72.22,32.65) v1(72.94,47.08) v1(72.99,52.41) v1(73.72,58.74) v1(77.51,90.44) v1(78.8,62.47) v1(79.49,90.44) v1(81.67,53.1) v1(84.49,43.42) v1(84.54,22.72) v1(85.71,146.42) v1(86.53,22.72) v1(87.69,146.42) v1(89.85,146.42) v1(89.98,43.42) v1(90.16,48.12) v1(90.36,64.05) v1(91.83,146.42) v1(92.85,90.34) v1(94.02,64.05) v1(94.83,90.34) v1(95.87,57.04) v1(96.38,105.47) v1(96.63,38.32) v1(96.63,34.48) v1(96.86,123.81) v1(98.36,105.47) v1(98.46,72.56) v1(98.84,123.81) v1(100.52,105.47) v1(101,123.81) v1(101.92,38.34) v1(101.92,34.48) v1(102.5,105.47) v1(102.98,123.81) v1(109.11,66.66) v1(109.74,88.25) v1(109.92,21.53) v1(110.38,38.01) v1(111.09,66.66) v1(111.72,88.25) v1(111.9,21.53) v1(117.01,73.49) v1(117.08,41.08) v1(120.69,51.73) v1(120.84,45.05) v1(120.92,69) v1(122.67,51.73) v1(122.82,45.05) v1(124.42,28.16) v1(127.37,45.05) v1(127.57,53.12) v1(129.35,45.05) v1(129.55,53.12) v1(134.48,57.85) v1(136.11,57.87) v1(136.46,21.35) v1(137.25,65.21) v1(138.44,21.35) v1(138.65,88.4) v1(138.98,78.63) v1(140.2,30.75) v1(140.63,88.4) v1(141.26,78.6) v1(141.39,101) v1(141.39,99.48) v1(141.39,97.8) v1(142.18,30.75) v1(143.24,78.6) v1(144.16,130.77) v1(146.14,130.77) v1(148.3,130.77) v1(149.34,55.94) v1(150.13,51.22) v1(150.28,130.77) v1(151.24,55.94) v1(158.99,56.25) v1(158.97,46.77) v1(159.07,65.04) v1(161.05,64.02) v1(164.81,55.82) v1(165.09,27.9) v1(165.42,14.8) v1(167.07,27.9) v1(167.4,14.8) v1(168.59,142.25) v1(168.59,140.04) v1(168.59,138.09) v1(168.59,136.11) v1(168.59,134.05)
V12: length 311
  Top Layer w0.762: D4.2 10.83,32.88 2.86,32.88 2.22,33.52 2.22,133.11 3.54,134.43 12.08,134.43 ; 5.99,32.57 arc(5.64,32.8) 5.23,32.88 arc(5.64,32.96) 5.99,33.19 ; 12.82,34.52 arc(12.5,34.46) 12.23,34.28 ; 11.58,33.62 arc(12.04,34.32) 12.21,35.14 ; 7.25,33.19 arc(7.6,32.96) 8.01,32.88 arc(7.6,32.8) 7.25,32.57
  Top Layer w1.27: 19.01,137.31 19.19,137.13 19.19,134.66 19.57,134.28 25.54,134.28 26.73,133.08 U1.1 ; 11.98,134.63 11.39,134.05 C2.1 ; 12.08,134.43 12.26,134.61 ; 147.13,141.67 U91.1 ; 19.62,136.45 arc(19.3,135.97) 19.19,135.41 ; 19.19,134.65 arc(18.99,135.62) 18.42,136.43
  Top Layer w2.032: 19.01,137.31 18.9,137.43 D1.2 11.98,134.43 ; 74.89,141.67 147.13,141.67
  Bottom Layer w2.032: 86.65,141.67 25.79,141.67 21.55,137.43 14.52,137.43
  vias: v2(74.92,141.67) v2(81.06,141.67) v2(86.8,141.67)
VCC_5V: length 436.2
  Top Layer w0.762: R1.1 9.77,106.16 ; C4.1 15.23,108.32
  Top Layer w1.27: U1.4 21.63,125.8 20.61,124.78 16.09,124.78 15.25,123.94 15.25,106.21 5.07,106.21 4.2,105.35 4.2,81.98 U3.3 ; 14.62,113.86 15.25,114.49 ; 14.62,113.86 L1.2 ; 14.62,113.86 arc(12.48,113.42) 10.67,112.2 ; 14.62,113.86 arc(12.48,114.29) 10.67,115.51 ; v2(36.28,136.54) R24.1 ; 4.74,95.49 6.16,95.49 7.51,96.84 10.27,96.84 arc(8.81,96.46) 7.7,95.42 ; v2(46.44,136.54) R26.1 ; 6.37,79.81 arc(6.67,79.61) 7.02,79.54 ; 7.96,96.84 arc(7.2,96.64) 6.63,96.1 ; 5.67,95.49 arc(6.17,95.59) 6.6,95.88
  Bottom Layer w1.27: J2.10 34.48,11.44 33.15,12.78 4.47,12.78 2.53,14.72 2.53,103.24 3.67,104.38 14.72,104.38 ; J-LAN7.6 145.86,105.75 144.62,107 144.62,110.17 134.53,120.26 134.53,135.17 131.13,138.57 38.32,138.57 34.28,134.53 16.75,134.53 15.1,132.88 v2(15.1,106.21) ; v2(46.44,136.54) 46.44,138.49
  vias: v2(13.25,106.21) v2(13.3,104.38) v2(15.1,104.33)
/RESET: length 23.9
  Top Layer w0.254: R59.1 R58.1 146.49,57.87 147.43,58.81 150.46,58.81 U4.3 ; 142.96,59.8 R57.1 ; 151.04,57.9 arc(150.98,58.2) 150.81,58.46 arc(151.07,58.29) 151.37,58.23 ; 142.96,60.5 arc(143.01,60.26) 143.15,60.05 ; 142.96,61.11 arc(143.06,60.64) 143.33,60.23 ; 143.28,57.56 arc(143.63,57.79) 144.04,57.87 arc(143.63,57.96) 143.28,58.19 ; 143.28,58.25 arc(143.05,58.6) 142.96,59.01 arc(142.88,58.6) 142.65,58.25 ; 143.15,59.66 arc(143.01,59.45) 142.96,59.21 ; 143.33,59.48 arc(143.06,59.07) 142.96,58.6 ; 142.96,58.84 arc(142.9,59.19) 142.7,59.48 ; 142.7,60.23 arc(142.9,60.53) 142.96,60.87 ; 142.65,61.48 arc(142.88,61.14) 142.96,60.73 arc(143.05,61.14) 143.28,61.48
/RESET1: length 13.3
  Top Layer w0.254: R57.2 132.04,59.86 131.13,58.94 U02.76 ; 140.36,59.54 arc(140.02,59.77) 139.6,59.86 arc(140.02,59.94) 140.36,60.17
/RESET2: length 19.7
  Top Layer w0.254: U02.64 137.52,49.66 v1(137.81,49.95) ; R58.2 140.6,57.85 v1(138.34,57.85) ; 139.49,57.85 arc(139.94,57.94) 140.31,58.19 ; 140.31,57.56 arc(139.99,57.77) 139.62,57.85 ; 138.52,57.67 arc(138.72,57.8) 138.95,57.85 arc(138.72,57.9) 138.52,58.03
  Bottom Layer w0.254: v1(137.81,49.95) 137.81,57.32 v1(138.34,57.85) ; 137.99,50.13 arc(137.85,50.33) 137.81,50.56 arc(137.76,50.33) 137.63,50.13 ; 138.34,57.59 arc(138.11,57.55) 137.91,57.41 arc(138.04,57.61) 138.09,57.85
A0: length 151.1
  Top Layer w0.254: U02.84 127.13,77.8 126,78.93 37.81,78.93 36.84,77.97 36.84,56.93 37.47,56.31 54.95,56.31
A1: length 155.1
  Top Layer w0.254: U02.83 127.63,78.57 126.61,79.59 36.74,79.59 36.13,78.98 36.13,56.45 36.78,55.81 54.95,55.81
A2: length 158.4
  Top Layer w0.254: U02.82 128.13,79.26 127.17,80.23 36.46,80.23 35.55,79.31 35.55,55.84 36.08,55.31 54.95,55.31
A3: length 161.8
  Top Layer w0.254: 54.95,54.81 35.64,54.81 35.01,55.44 35.01,79.95 35.98,80.91 127.65,80.91 128.63,79.93 U02.81
A4: length 165.5
  Top Layer w0.254: 54.95,54.31 35,54.31 34.66,54.65 34.35,54.95 34.35,80.3 35.67,81.62 128.41,81.62 129.13,80.9 U02.80
A5: length 168.9
  Top Layer w0.254: U02.79 129.63,81.42 128.87,82.18 35.22,82.18 33.64,80.61 33.64,54.37 34.2,53.81 54.95,53.81
A6: length 85.4
  Top Layer w0.254: U02.29 120.63,28.48 119.62,27.47 62.67,27.47 62.23,27.92 62.23,38.49 63.5,39.76 U01.50
A7: length 80.6
  Top Layer w0.254: U02.28 120.13,28.89 119.22,27.98 65.49,27.98 65,28.47 U01.53
A8: length 78.6
  Top Layer w0.254: U01.54 65.5,29.17 66.1,28.56 119.04,28.56 119.63,29.16 U02.27
